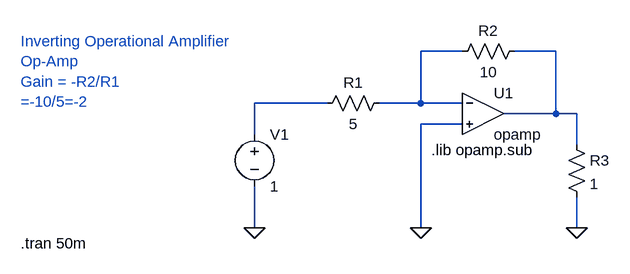
[diagram p0: schematic InvertingOpAmp.asc]
InvertingOpAmp.asc, the LTspice schematic file:
Version 4.1
SHEET 1 880 680
WIRE 512 64 448 64
WIRE 656 64 592 64
WIRE 304 144 192 144
WIRE 448 144 448 64
WIRE 448 144 384 144
WIRE 512 144 448 144
WIRE 656 160 656 64
WIRE 656 160 576 160
WIRE 688 160 656 160
WIRE 512 176 448 176
WIRE 192 192 192 144
WIRE 688 208 688 160
WIRE 192 336 192 272
WIRE 448 336 448 176
WIRE 688 336 688 288
FLAG 192 336 0
FLAG 448 336 0
FLAG 688 336 0
SYMBOL voltage 192 176 R0
WINDOW 123 0 0 Left 0
WINDOW 39 0 0 Left 0
SYMATTR InstName V1
SYMATTR Value 1
SYMBOL res 400 128 R90
WINDOW 0 0 56 VBottom 2
WINDOW 3 32 56 VTop 2
SYMATTR InstName R1
SYMATTR Value 5
SYMBOL res 608 48 R90
WINDOW 0 0 56 VBottom 2
WINDOW 3 32 56 VTop 2
SYMATTR InstName R2
SYMATTR Value 10
SYMBOL OpAmps\\opamp 544 96 R0
SYMATTR InstName U1
SYMBOL res 672 192 R0
SYMATTR InstName R3
SYMATTR Value 1
TEXT -168 48 Left 2 ;Inverting Operational Amplifier\nOp-Amp\nGain = -R2/R1\n=-10/5=-2
TEXT 464 216 Left 2 !.lib opamp.sub
TEXT -168 360 Left 2 !.tran 50m

The netlist it stands for:
* InvertingOpAmp.asc
V1 N003 0 1
R1 N001 N003 5
R2 N002 N001 10
X§U1 N001 0 N002 opamp Aol=100K GBW=10Meg  ; pins invin noninvin out
R3 N002 0 1
* Inverting Operational Amplifier
* Op-Amp
* Gain = -R2/R1
* =-10/5=-2
.lib opamp.sub
.tran 50m
.backanno
.end